# Altium project PA_stage_Thesis.PrjPcb
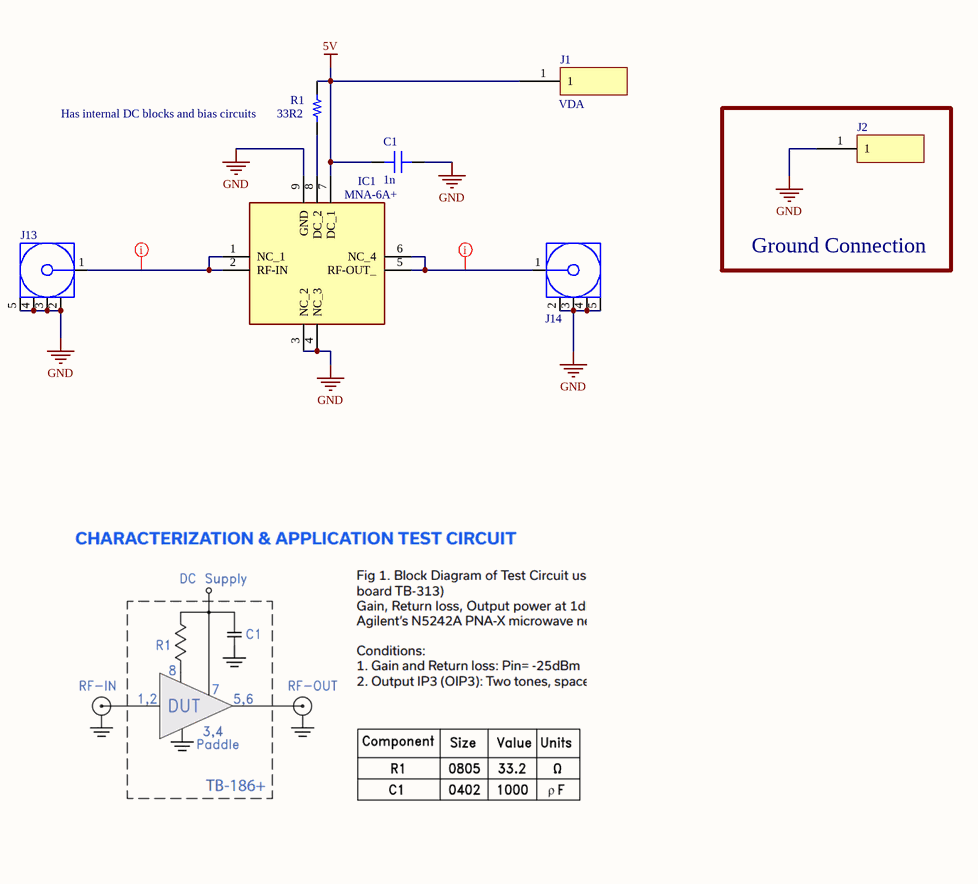
[diagram p0: MNA6A.SchDoc]
4 sheets, 98 parts. Net scope: global (net labels, ports and power ports of the same name join across sheets).
Board file: PCB1.PcbDoc
Sheets:
  MNA6A.SchDoc
  QPA9120.SchDoc
  TQP9111_Sparam_opt.SchDoc
  TQP9111_Devboard_opt.SchDoc

## Sheet MNA6A.SchDoc
size A4; SheetNumber: 1; SheetTotal: 4

### Parts
C1  1n  [CAP 0603_1608 RF]
IC1  MNA-6A+  [MNA6A]
J1  Nail_Head  [Nail_Head]  (value not drawn)
J2  Nail_Head  [Nail_Head]  (value not drawn)
J13  60312202114513  [60312202114513]  (value not drawn)
J14  60312202114513  [60312202114513]  (value not drawn)
R1  33R2  [RES 0805_2012]

### Blocks framed on the sheet
Ground Connection: J2

### Nets
5V: C1.1 IC1.7(DC_1) J1.1 R1.2
GND: C1.2 IC1.3(NC_2) IC1.4(NC_3) IC1.9(GND) J2.1 J13.2(GND) J13.3(GND) J13.4(GND) J13.5(GND) J14.2(GND) J14.3(GND) J14.4(GND) J14.5(GND)
NetIC1_1: IC1.1(NC_1) IC1.2(RF-IN) J13.1(Signal)
NetIC1_5: IC1.5(RF-OUT_) IC1.6(NC_4) J14.1(Signal)
NetIC1_8: IC1.8(DC_2) R1.1

### Layout directives
net class CPWG: NetIC1_1, NetIC1_5

### Notes on the sheet
- (near R1) Has internal DC blocks and bias circuits
- (near J1) VDA

### Library data of the parts
C1 = UMK107SD102JA-T: CAP CER 1000PF 50V 0603; manufacturer: Taiyo Yuden; Tolerance: ±5%; Part Number: UMK107SD102JA-T; Applications: RF, Microwave, High Frequency; Capacitance: 1000pF; componentlink1description: Datasheet; componentlink1url: http://www.yuden.co.jp/productdata/catalog/mlcc07_e.pdf; componentlink2description: DigiKey Link; componentlink2url: http://digikey.com/product-detail/en/taiyo-yuden/UMK107SD102JA-T/587-1069-1-ND/930846; Device Package: 0603 (1608 Metric); Features: Low Distortion; lastupdated: 02/09/2020 01:17:16; Lifecycle Status: Active; Minimum Order: 1; Mounting Type: Surface Mount, MLCC; Operating Temperature: -55°C ~ 125°C; Package / Case: 0603 (1608 Metric); packaging: TapeAndReel; partid: 885; Part Status: Active; price: 0.07; series: CFCAP™; Size / Dimension: 0.063" L x 0.031" W (1.60mm x 0.80mm); Supplier 1: DigiKey; Supplier Part Number 1: 587-1069-1-ND; Thickness (Max): 0.035" (0.90mm); value: 1000pF; Voltage - Rated: 50V
IC1 = MNA-6A+: Integrated Circuit; Manufacturer_Name: Mini-Circuits; Height: 0.9916mm; Manufacturer_Part_Number: MNA-6A+; Mouser Part Number: 139-MNA-6A; Mouser Price/Stock: https://www.mouser.co.uk/ProductDetail/Mini-Circuits/MNA-6A%2b?qs=xZ%2FP%252Ba9zWqa51VJkRRE67Q%3D%3D; Supplier 1: Digi-Key; Supplier Part Number 1: 3157-MNA-6A+CT-ND
J1 J2 = Nail_Head: 1460-2-00-80-00-00-03-0 Mill-Max; Supplier 1: Farnell; Supplier Part Number 1: 3889056
J13 J14 = 60312202114513: WR-SMA Connector, PCB End Launch Jack, 6.35SQ Flange Flat Tab 1.6mm, DC~18GHz, 50Ohm; Manufacturer: Wurth Elektronik; Center Contact Diameter: 0.51 WIDE x 0.25 THK; Connector Type: SMA; Interface Type: MIL-STD-348; Manufacturer Part Number: 60312202114513; Category: Coaxial Connectors; Match Code: WR-SMA; ComponentLink1Description: Website Link; ComponentLink1URL: https://www.we-online.com/redexpert/article/60312202114513?ad; ComponentLink2Description: Datasheet Link; ComponentLink2URL: https://www.we-online.com/redexpert/spec/60312202114513?ad; Mount: End Launch; Operating Temperature Max: 165°C; Operating Temperature Min: -65°C; Packaging: Tray; Frequency Range: DC~18GHz; Gender: Jack; Impedance: 50Ohm; Orientation: Straight
R1 = RCS080533R2FKEA: RES SMD 33.2 OHM 1% 1/2W 0805; Manufacturer: Vishay Dale; Power (Watts): 0.5W, 1/2W; Resistance: 33.2 Ohms; Temperature Coefficient: ±100ppm/°C; Part Number: RCS080533R2FKEA; Value: 33R2; ComponentLink1Description: Datasheet; ComponentLink1URL: http://www.vishay.com/docs/20065/rcse3.pdf; ComponentLink2Description: DigiKey Link; ComponentLink2URL: https://www.digikey.com/en/products/detail/vishay-dale/RCS080533R2FKEA/5866976; Composition: Thick Film; Device Package: 0805 (2012 Metric); Features: Automotive AEC-Q200, Pulse Withstanding; Height - Seated (Max): 0.020" (0.50mm); LastUpdated: 21/05/2023 19:41:30; Lifecycle Status: Active; Minimum Order: 1; Number of Terminations: 2; Operating Temperature: -55°C ~ 155°C; Package / Case: 0805 (2012 Metric); Packaging: TapeAndReel; PartId: 34966; Part Status: Active; Price: 0.02; Ratings: AEC-Q200; Series: RCS e3; Size / Dimension: 0.079" L x 0.049" W (2.00mm x 1.25mm); Supplier 1: DigiKey; Supplier Part Number 1: 541-2830-1-ND; Supplier Device Package: 0805; Tolerance: ±1%

## Sheet QPA9120.SchDoc
size A4; SheetNumber: 2; SheetTotal: 4
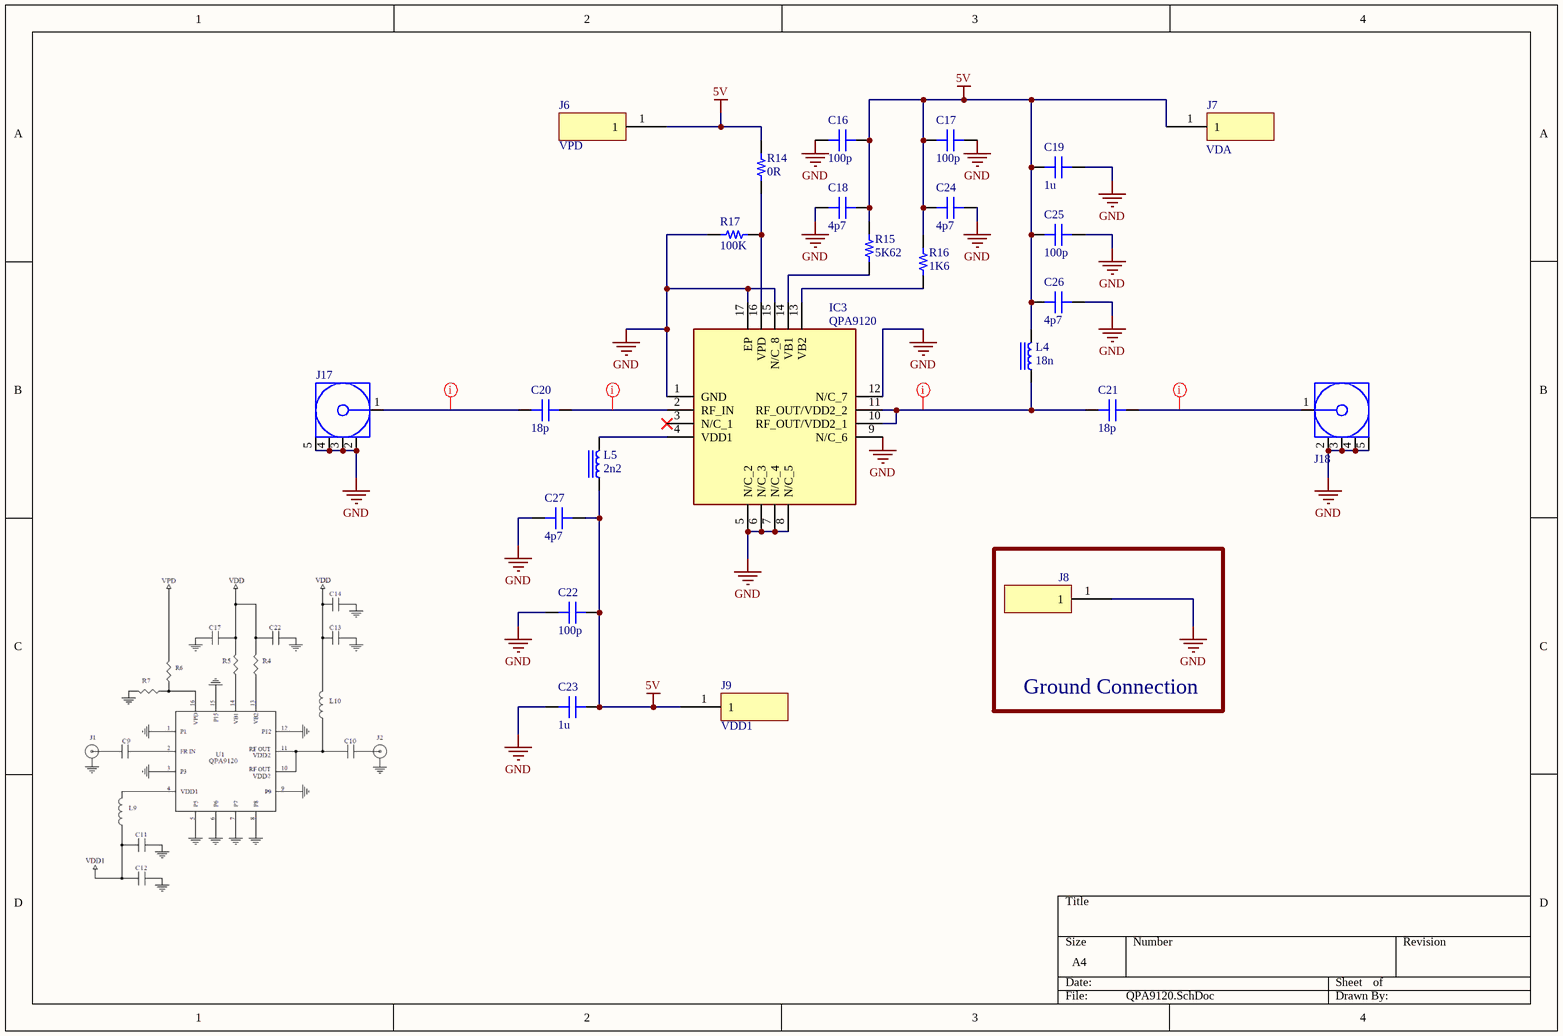
[diagram p1: QPA9120.SchDoc]

### Parts
C16  100p  [CAP 0603_1608 RF]
C17  100p  [CAP 0603_1608 RF]
C18  4p7  [CAP 0402_1005 RF]
C19  1u  [CAP 0603_1608]
C20  18p  [CAP 0402_1005 RF]
C21  18p  [CAP 0402_1005 RF]
C22  100p  [CAP 0603_1608 RF]
C23  1u  [CAP 0603_1608]
C24  4p7  [CAP 0402_1005 RF]
C25  100p  [CAP 0603_1608 RF]
C26  4p7  [CAP 0402_1005 RF]
C27  4p7  [CAP 0402_1005 RF]
IC3  QPA9120  [QFN50P300X300X86-17N-D]
J6  Nail_Head  [Nail_Head]  (value not drawn)
J7  Nail_Head  [Nail_Head]  (value not drawn)
J8  Nail_Head  [Nail_Head]  (value not drawn)
J9  Nail_Head  [Nail_Head]  (value not drawn)
J17  60312202114513  [60312202114513]  (value not drawn)
J18  60312202114513  [60312202114513]  (value not drawn)
L4  18n  [IND 0402_1005 RF WW]
L5  2n2  [IND 0402_1005 RF WW]
R14  0R  [RES 0603_1608]
R15  5K62  [RES 0402_1005]
R16  1K6  [RES 0402_1005]
R17  100K  [RES 0402_1005]

### Blocks framed on the sheet
Ground Connection: J8

### Nets
5V: C16.2 C17.1 C18.2 C19.1 C22.2 C23.2 C24.1 C25.1 C26.1 C27.2 J6.1 J7.1 J9.1 L4.2 L5.1 R14.2 R15.2 R16.2
GND: C16.1 C17.2 C18.1 C19.2 C22.1 C23.1 C24.2 C25.2 C26.2 C27.1 IC3.1(GND) IC3.5(N/C_2) IC3.6(N/C_3) IC3.7(N/C_4) IC3.8(N/C_5) IC3.9(N/C_6) IC3.12(N/C_7) IC3.15(N/C_8) IC3.17(EP) J8.1 J17.2(GND) J17.3(GND) J17.4(GND) J17.5(GND) J18.2(GND) J18.3(GND) J18.4(GND) J18.5(GND) R17.1
NetC20_1: C20.1 J17.1(Signal)
NetC20_2: C20.2 IC3.2(RF_IN)
NetC21_1: C21.1 IC3.10(RF_OUT/VDD2_1) IC3.11(RF_OUT/VDD2_2) L4.1
NetC21_2: C21.2 J18.1(Signal)
NetIC3_4: IC3.4(VDD1) L5.2
NetIC3_13: IC3.13(VB2) R16.1
NetIC3_14: IC3.14(VB1) R15.1
NetIC3_16: IC3.16(VPD) R14.1 R17.2

Not connected (* = marked no-connect by the designer): IC3 3(N/C_1)*

### Layout directives
net class CPWG: NetC20_1, NetC20_2, NetC21_1, NetC21_2

### Notes on the sheet
- (near J6) VPD
- (near J7) VDA
- (near J9) VDD1

### Library data of the parts
C16 C17 C22 C25 = 600S101GW250XT: CAP CER 100PF 250V NP0 0603; manufacturer: American Technical Ceramics; Temperature Coefficient: C0G, NP0; Tolerance: ±2%; Part Number: 600S101GW250XT; Applications: RF, Microwave, High Frequency, Bypass, Decoupling; Capacitance: 100 pF; componentlink1description: Datasheet; componentlink1url: http://www.atceramics.com/UserFiles/600s.pdf; componentlink2description: DigiKey Link; componentlink2url: https://www.digikey.com/en/products/detail/american-technical-ceramics/600S101GW250XT/3908987; Device Package: 0603 (1608 Metric); Features: High Q, Low Loss, Ultra Low ESR; lastupdated: 08/02/2024 21:16:59; Lifecycle Status: Active; Minimum Order: 1; Mounting Type: Surface Mount, MLCC; Operating Temperature: -55°C ~ 125°C; Package / Case: 0603 (1608 Metric); packaging: TapeAndReel; partid: 2165; Part Status: Active; price: 0.66; series: ATC 600S; Size / Dimension: 0.063" L x 0.032" W (1.60mm x 0.81mm); Supplier 1: DigiKey; Supplier Part Number 1: 1284-1931-1-ND; Thickness (Max): 0.035" (0.89mm); value: 100 pF; Voltage - Rated: 250V
C18 C24 C26 C27 = 600L4R7BT200T: CAP CER 4.7PF 200V C0G/NP0 0402; manufacturer: American Technical Ceramics; Temperature Coefficient: C0G, NP0; Tolerance: ±0.1pF; Part Number: 600L4R7BT200T; Applications: RF, Microwave, High Frequency, Bypass, Decoupling; Capacitance: 4.7 pF; componentlink1description: Datasheet; componentlink1url: http://www.atceramics.com/UserFiles/600l.pdf; componentlink2description: DigiKey Link; componentlink2url: https://www.digikey.com/en/products/detail/american-technical-ceramics/600L4R7BT200T/3905170; Device Package: 0402 (1005 Metric); Features: High Q, Low Loss, Ultra Low ESR; lastupdated: 08/02/2024 21:11:52; Lifecycle Status: Active; Minimum Order: 1; Mounting Type: Surface Mount, MLCC; Operating Temperature: -55°C ~ 125°C; Package / Case: 0402 (1005 Metric); packaging: TapeAndReel; partid: 546; Part Status: Active; price: 0.28; series: ATC 600L; Size / Dimension: 0.040" L x 0.020" W (1.02mm x 0.51mm); Supplier 1: DigiKey; Supplier Part Number 1: 1284-1129-1-ND; Thickness (Max): 0.024" (0.60mm); value: 4.7 pF; Voltage - Rated: 200V
C19 C23 = GCM188R71E105KA64J: CAP CER 1UF 25V X7R 0603; manufacturer: Murata Electronics; Capacitance: 1 µF; Tolerance: ±10%; Part Number: GCM188R71E105KA64J; Value: 1u; Applications: Automotive; componentlink1description: Datasheet; componentlink1url: https://www.murata.com/-/media/webrenewal/support/library/catalog/products/capacitor/ceramiccapacitor/c03e.ashx?la=en-us&cvid=20200707014404000000; componentlink2description: DigiKey Link; componentlink2url: https://www.digikey.com/en/products/detail/murata-electronics/GCM188R71E105KA64J/4903957; Device Package: 0603 (1608 Metric); lastupdated: 09/02/2024 20:09:55; Lifecycle Status: Active; Minimum Order: 1; Mounting Type: Surface Mount, MLCC; Operating Temperature: -55°C ~ 125°C; Package / Case: 0603 (1608 Metric); packaging: TapeAndReel; partid: 34745; Part Status: Active; price: 0.02; Ratings: AEC-Q200; series: GCM; Size / Dimension: 0.063" L x 0.031" W (1.60mm x 0.80mm); Supplier 1: DigiKey; Supplier Part Number 1: 490-GCM188R71E105KA64JCT-ND; Temperature Coefficient: X7R; Thickness (Max): 0.035" (0.90mm); Voltage - Rated: 25V
C20 C21 = 600L180GT200T: CAP CER 18PF 200V NP0 0402; manufacturer: American Technical Ceramics; Temperature Coefficient: C0G, NP0; Tolerance: ±2%; Part Number: 600L180GT200T; Applications: RF, Microwave, High Frequency, Bypass, Decoupling; Capacitance: 18 pF; componentlink1description: Datasheet; componentlink1url: http://www.atceramics.com/UserFiles/600l.pdf; componentlink2description: DigiKey Link; componentlink2url: https://www.digikey.com/en/products/detail/american-technical-ceramics/600L180GT200T/3908919; Device Package: 0402 (1005 Metric); Features: High Q, Low Loss, Ultra Low ESR; lastupdated: 08/02/2024 21:11:47; Lifecycle Status: Active; Minimum Order: 1; Mounting Type: Surface Mount, MLCC; Operating Temperature: -55°C ~ 125°C; Package / Case: 0402 (1005 Metric); packaging: TapeAndReel; partid: 2016; Part Status: Active; price: 0.49; series: ATC 600L; Size / Dimension: 0.040" L x 0.020" W (1.02mm x 0.51mm); Supplier 1: DigiKey; Supplier Part Number 1: 1284-1910-1-ND; Thickness (Max): 0.024" (0.60mm); value: 18 pF; Voltage - Rated: 200V
IC3 = QPA9120: Integrated Circuit; Manufacturer_Name: Qorvo; Datasheet Link: https://www.qorvo.com/products/d/da006507; Height: 0.855mm; Manufacturer_Part_Number: QPA9120; Mouser Part Number: N/A; Mouser Price/Stock: https://www.mouser.com/Search/Refine.aspx?Keyword=N%2FA
J6-J9 = Nail_Head: 1460-2-00-80-00-00-03-0 Mill-Max; Supplier 1: Farnell; Supplier Part Number 1: 3889056
J17 J18 = 60312202114513: as J13 on sheet MNA6A; Manufacturer Part Number: 60312202114513; Category: Coaxial Connectors; Match Code: WR-SMA; ComponentLink1Description: Website Link; ComponentLink1URL: https://www.we-online.com/redexpert/article/60312202114513?ad; ComponentLink2Description: Datasheet Link; ComponentLink2URL: https://www.we-online.com/redexpert/spec/60312202114513?ad; Mount: End Launch; Operating Temperature Max: 165°C; Operating Temperature Min: -65°C; Packaging: Tray; Frequency Range: DC~18GHz; Gender: Jack; Impedance: 50Ohm; Orientation: Straight
L4 = LQW15AN18NG8ZD: FIXED IND 18NH 1.05A 0.13OHM SMD; Manufacturer: Murata Electronics; DC Resistance (DCR): 130mOhm Max; Frequency - Self Resonant: 5.2GHz; Inductance Frequency - Test: 100 MHz; Material - Core: Non-Magnetic; Q @ Freq: 30 @ 250MHz; Shielding: Unshielded; Tolerance: ±2%; Type: Drum Core, Wirewound; Part Number: LQW15AN18NG8ZD; ComponentLink1Description: Datasheet; ComponentLink1URL: https://search.murata.co.jp/Ceramy/image/img/P02/JELF243A-9138.pdf; ComponentLink2Description: DigiKey Link; ComponentLink2URL: https://www.digikey.com/en/products/detail/murata-electronics/LQW15AN18NG8ZD/6798772; Current Rating (Amps): 1.05 A; Device Package: 0402 (1005 Metric); Height - Seated (Max): 0.024" (0.60mm); Inductance: 18 nH; LastUpdated: 11/03/2024 07:55:40; Lifecycle Status: Active; Minimum Order: 1; Mounting Type: Surface Mount; Operating Temperature: -55°C ~ 125°C; Package / Case: 0402 (1005 Metric); Packaging: TapeAndReel; PartId: 193; Part Status: Active; Price: 0.07; Ratings: AEC-Q200; Series: LQW15; Size / Dimension: 0.039" L x 0.024" W (1.00mm x 0.60mm); Supplier 1: DigiKey; Supplier Part Number 1: 490-15347-1-ND; Supplier Device Package: 0402 (1005 Metric); Value: 18 nH
L5 = LQW15AN2N2D8ZD: FIXED IND 2.2NH 2.53A 0.022OHM; Manufacturer: Murata Electronics; DC Resistance (DCR): 22mOhm Max; Frequency - Self Resonant: 15.5GHz; Inductance Frequency - Test: 100 MHz; Material - Core: Non-Magnetic; Q @ Freq: 30 @ 250MHz; Shielding: Unshielded; Tolerance: ±0.5nH; Type: Drum Core, Wirewound; Part Number: LQW15AN2N2D8ZD; ComponentLink1Description: Datasheet; ComponentLink1URL: https://search.murata.co.jp/Ceramy/image/img/P02/JELF243A-9138.pdf; ComponentLink2Description: DigiKey Link; ComponentLink2URL: https://www.digikey.com/en/products/detail/murata-electronics/LQW15AN2N2D8ZD/6798802; Current Rating (Amps): 2.53 A; Device Package: 0402 (1005 Metric); Height - Seated (Max): 0.024" (0.60mm); Inductance: 2.2 nH; LastUpdated: 11/03/2024 07:55:41; Lifecycle Status: Active; Minimum Order: 1; Mounting Type: Surface Mount; Operating Temperature: -55°C ~ 125°C; Package / Case: 0402 (1005 Metric); Packaging: TapeAndReel; PartId: 45; Part Status: Active; Price: 0.06; Ratings: AEC-Q200; Series: LQW15; Size / Dimension: 0.039" L x 0.024" W (1.00mm x 0.60mm); Supplier 1: DigiKey; Supplier Part Number 1: 490-15377-1-ND; Supplier Device Package: 0402 (1005 Metric); Value: 2.2 nH
R14 = JR0603X26E: 0603 26 AMP JUMPER; Manufacturer: Ohmite; Power (Watts): 0.135W; Resistance: 0 Ohms; Part Number: JR0603X26E; Value: 0R; ComponentLink1Description: Datasheet; ComponentLink1URL: https://www.ohmite.com/assets/docs/res_jr.pdf?r=false; ComponentLink2Description: DigiKey Link; ComponentLink2URL: https://www.digikey.com/en/products/detail/ohmite/JR0603X26E/10233371; Composition: Metal Element; Device Package: 0603 (1608 Metric); Height - Seated (Max): 0.022" (0.55mm); LastUpdated: 12/04/2023 19:32:57; Lifecycle Status: Active; Minimum Order: 1; Number of Terminations: 2; Operating Temperature: -55°C ~ 150°C; Package / Case: 0603 (1608 Metric); Packaging: TapeAndReel; PartId: 6812; Part Status: Active; Price: 0.10; Series: JR; Size / Dimension: 0.063" L x 0.031" W (1.60mm x 0.80mm); Supplier 1: DigiKey; Supplier Part Number 1: JR0603X26ECT-ND; Supplier Device Package: 0603; Tolerance: Jumper
R15 = CRCW04025K62FKED: RES SMD 5.62K OHM 1% 1/16W 0402; Manufacturer: Vishay Dale; Power (Watts): 0.063W, 1/16W; Resistance: 5.62 kOhms; Temperature Coefficient: ±100ppm/°C; Part Number: CRCW04025K62FKED; Value: 5K62; ComponentLink1Description: Datasheet; ComponentLink1URL: http://www.vishay.com/docs/20035/dcrcwe3.pdf; ComponentLink2Description: DigiKey Link; ComponentLink2URL: https://www.digikey.com/en/products/detail/vishay-dale/CRCW04025K62FKED/1178093; Composition: Thick Film; Device Package: 0402 (1005 Metric); Features: Automotive AEC-Q200; Height - Seated (Max): 0.016" (0.40mm); LastUpdated: 09/02/2024 20:29:38; Lifecycle Status: Active; Minimum Order: 1; Number of Terminations: 2; Operating Temperature: -55°C ~ 155°C; Package / Case: 0402 (1005 Metric); Packaging: TapeAndReel; PartId: 16234; Part Status: Active; Price: 0.01; Ratings: AEC-Q200; Series: CRCW; Size / Dimension: 0.039" L x 0.020" W (1.00mm x 0.50mm); Supplier 1: DigiKey; Supplier Part Number 1: 541-5.62KLCT-ND; Supplier Device Package: 0402; Tolerance: ±1%
R16 = CR0402-FX-1601GLF: RES SMD 1.6K OHM 1% 1/16W 0402; Manufacturer: Bourns Inc.; Power (Watts): 0.063W, 1/16W; Resistance: 1.6 kOhms; Temperature Coefficient: ±100ppm/°C; Part Number: CR0402-FX-1601GLF; Value: 1K6; ComponentLink1Description: Datasheet; ComponentLink1URL: https://www.bourns.com/docs/Product-Datasheets/CR0402.pdf; ComponentLink2Description: DigiKey Link; ComponentLink2URL: https://www.digikey.com/en/products/detail/bourns-inc/CR0402-FX-1601GLF/3783173; Composition: Thick Film; Device Package: 0402 (1005 Metric); Height - Seated (Max): 0.016" (0.40mm); LastUpdated: 09/02/2024 20:29:47; Lifecycle Status: Active; Minimum Order: 1; Number of Terminations: 2; Operating Temperature: -55°C ~ 155°C; Package / Case: 0402 (1005 Metric); Packaging: CutTape; PartId: 12857; Part Status: Active; Price: 0.01; Series: CR0402; Size / Dimension: 0.039" L x 0.020" W (1.00mm x 0.50mm); Supplier 1: DigiKey; Supplier Part Number 1: CR0402-FX-1601GLFCT-ND; Supplier Device Package: 0402; Tolerance: ±1%
R17 = CRCW0402100KFKEDHP: RES SMD 100K OHM 1% 1/5W 0402; Manufacturer: Vishay Dale; Power (Watts): 0.2W, 1/5W; Resistance: 100 kOhms; Temperature Coefficient: ±100ppm/°C; Part Number: CRCW0402100KFKEDHP; Value: 100K; ComponentLink1Description: Datasheet; ComponentLink1URL: http://www.vishay.com/docs/20043/crcwhpe3.pdf; ComponentLink2Description: DigiKey Link; ComponentLink2URL: https://www.digikey.com/en/products/detail/vishay-dale/CRCW0402100KFKEDHP/2222540; Composition: Thick Film; Device Package: 0402 (1005 Metric); Features: Automotive AEC-Q200, Pulse Withstanding; Height - Seated (Max): 0.016" (0.40mm); LastUpdated: 09/02/2024 20:29:48; Lifecycle Status: Active; Minimum Order: 1; Number of Terminations: 2; Operating Temperature: -55°C ~ 155°C; Package / Case: 0402 (1005 Metric); Packaging: TapeAndReel; PartId: 12749; Part Status: Active; Price: 0.01; Ratings: AEC-Q200; Series: CRCW-HP; Size / Dimension: 0.039" L x 0.020" W (1.00mm x 0.50mm); Supplier 1: DigiKey; Supplier Part Number 1: 541-100KYCT-ND; Supplier Device Package: 0402; Tolerance: ±1%

## Sheet TQP9111_Sparam_opt.SchDoc
size A4; SheetNumber: 3; SheetTotal: 4
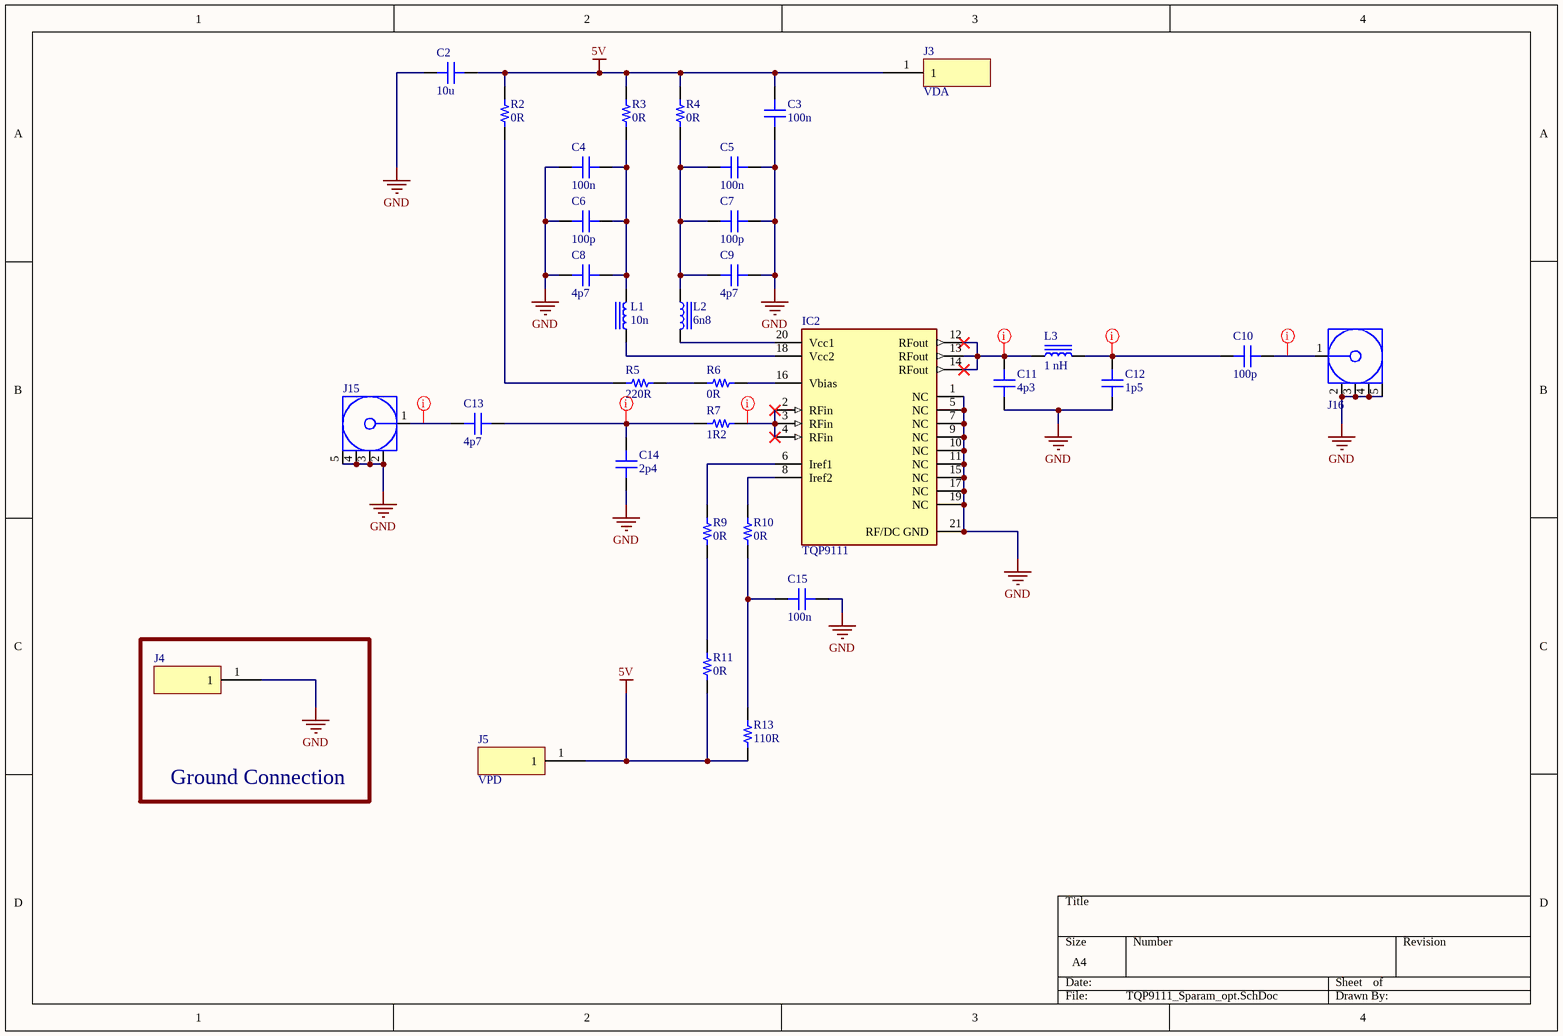
[diagram p2: TQP9111_Sparam_opt.SchDoc]

### Parts
C2  10u  [CAP 0805_2012]
C3  100n  [CAP 0603_1608]
C4  100n  [CAP 0603_1608]
C5  100n  [CAP 0603_1608]
C6  100p  [CAP 0603_1608 RF]
C7  100p  [CAP 0603_1608 RF]
C8  4p7  [CAP 0402_1005 RF]
C9  4p7  [CAP 0402_1005 RF]
C10  100p  [0603_SPECIAL]
C11  4p3  [0402_special]  (mechanical)
C12  1p5  [0402_special]
C13  4p7  [0402_SPECIAL_3]
C14  2p4  [0402_special]
C15  100n  [CAP 0603_1608]
IC2  TQP9111  [FP-TQP9111-MFG]
J3  Nail_Head  [Nail_Head]  (value not drawn)
J4  Nail_Head  [Nail_Head]  (value not drawn)
J5  Nail_Head  [Nail_Head]  (value not drawn)
J15  60312202114513  [60312202114513]  (value not drawn)
J16  60312202114513  [60312202114513]  (value not drawn)
L1  10n  [IND 0603_1608 RF WW]
L2  6n8  [IND 0402_1005 RF WW]
L3  1 nH  [0402]
R2  0R  [RES 0603_1608]
R3  0R  [RES 0603_1608]
R4  0R  [RES 0603_1608]
R5  220R  [RES 0603_1608]
R6  0R  [RES 0603_1608]
R7  1R2  [0402_Special_2]
R9  0R  [RES 0603_1608]
R10  0R  [RES 0603_1608]
R11  0R  [RES 0603_1608]
R13  110R  [RES 0603_1608]

### Blocks framed on the sheet
Ground Connection: J4

### Nets
5V: C2.2 C3.2 J3.1 J5.1 R2.2 R3.2 R4.2 R11.1 R13.1
GND: C2.1 C3.1 C4.1 C5.2 C6.1 C7.2 C8.1 C9.2 C11.1 C12.1 C14.1 C15.2 IC2.1(NC) IC2.5(NC) IC2.7(NC) IC2.9(NC) IC2.10(NC) IC2.11(NC) IC2.15(NC) IC2.17(NC) IC2.19(NC) IC2.21(RF/DC_GND) J4.1 J15.2(GND) J15.3(GND) J15.4(GND) J15.5(GND) J16.2(GND) J16.3(GND) J16.4(GND) J16.5(GND)
NetC4_2: C4.2 C6.2 C8.2 L1.2 R3.1
NetC5_1: C5.1 C7.1 C9.1 L2.2 R4.1
NetC10_1: C10.1 C12.2 L3.2
NetC10_2: C10.2 J16.1(Signal)
NetC11_2: C11.2 IC2.12(RFout) IC2.13(RFout) IC2.14(RFout) L3.1
NetC13_1: C13.1 J15.1(Signal)
NetC13_2: C13.2 C14.2 R7.1
NetC15_1: C15.1 R10.1 R13.2
NetIC2_2: IC2.2(RFin) IC2.3(RFin) IC2.4(RFin) R7.2
NetIC2_6: IC2.6(Iref1) R9.2
NetIC2_8: IC2.8(Iref2) R10.2
NetIC2_16: IC2.16(Vbias) R6.1
NetIC2_18: IC2.18(Vcc2) L1.1
NetIC2_20: IC2.20(Vcc1) L2.1
NetR2_1: R2.1 R5.1
NetR5_2: R5.2 R6.2
NetR9_1: R9.1 R11.2

### Layout directives
net class CPWG_2: NetC10_1, NetC10_2, NetC11_2, NetC13_1, NetC13_2, NetIC2_2

### Notes on the sheet
- (near J3) VDA
- (near J5) VPD

### Library data of the parts
C2 = GRM21BR61H106KE43L: CAP CER 10UF 50V X5R 0805; Value: 10 µF; Part Number: GRM21BR61H106KE43L
C3-C5 C15 = C0603X104K5RAC3316: CAP CER 0603 0.1UF 50V X7R 10%; manufacturer: KEMET; Capacitance: 0.1 µF; Part Number: C0603X104K5RAC3316; Value: 100n; Applications: Automotive, Boardflex Sensitive; componentlink1description: Datasheet; componentlink1url: https://api.kemet.com/component-edge/download/datasheet/C0603X104K5RAC3316.pdf; componentlink2description: DigiKey Link; componentlink2url: https://www.digikey.com/en/products/detail/kemet/C0603X104K5RAC3316/10315788; Device Package: 0603 (1608 Metric); Features: Soft Termination; lastupdated: 26/04/2023 19:06:00; Lifecycle Status: Active; Minimum Order: 1; Mounting Type: Surface Mount, MLCC; Operating Temperature: -55°C ~ 125°C; Package / Case: 0603 (1608 Metric); packaging: TapeAndReel; partid: 11116; Part Status: Active; price: 0.02; Ratings: AEC-Q200; series: SMD Auto X7R VW80808; Size / Dimension: 0.063" L x 0.031" W (1.60mm x 0.80mm); Supplier 1: DigiKey; Supplier Part Number 1: 399-C0603X104K5RAC3316CT-ND; Temperature Coefficient: X7R; Thickness (Max): 0.037" (0.95mm); Tolerance: ±10%; Voltage - Rated: 50V
C6 C7 C10 = 600S101GW250XT: as C16 on sheet QPA9120; Part Number: 600S101GW250XT; Applications: RF, Microwave, High Frequency, Bypass, Decoupling; Capacitance: 100 pF; componentlink1description: Datasheet; componentlink1url: http://www.atceramics.com/UserFiles/600s.pdf; componentlink2description: DigiKey Link; componentlink2url: https://www.digikey.com/en/products/detail/american-technical-ceramics/600S101GW250XT/3908987; Device Package: 0603 (1608 Metric); Features: High Q, Low Loss, Ultra Low ESR; lastupdated: 08/02/2024 21:16:59; Lifecycle Status: Active; Minimum Order: 1; Mounting Type: Surface Mount, MLCC; Operating Temperature: -55°C ~ 125°C; Package / Case: 0603 (1608 Metric); packaging: TapeAndReel; partid: 2165; Part Status: Active; price: 0.66; series: ATC 600S; Size / Dimension: 0.063" L x 0.032" W (1.60mm x 0.81mm); Supplier 1: DigiKey; Supplier Part Number 1: 1284-1931-1-ND; Thickness (Max): 0.035" (0.89mm); value: 100 pF; Voltage - Rated: 250V
C8 C9 C13 = 600L4R7BT200T: as C18 on sheet QPA9120; Part Number: 600L4R7BT200T; Applications: RF, Microwave, High Frequency, Bypass, Decoupling; Capacitance: 4.7 pF; componentlink1description: Datasheet; componentlink1url: http://www.atceramics.com/UserFiles/600l.pdf; componentlink2description: DigiKey Link; componentlink2url: https://www.digikey.com/en/products/detail/american-technical-ceramics/600L4R7BT200T/3905170; Device Package: 0402 (1005 Metric); Features: High Q, Low Loss, Ultra Low ESR; lastupdated: 08/02/2024 21:11:52; Lifecycle Status: Active; Minimum Order: 1; Mounting Type: Surface Mount, MLCC; Operating Temperature: -55°C ~ 125°C; Package / Case: 0402 (1005 Metric); packaging: TapeAndReel; partid: 546; Part Status: Active; price: 0.28; series: ATC 600L; Size / Dimension: 0.040" L x 0.020" W (1.02mm x 0.51mm); Supplier 1: DigiKey; Supplier Part Number 1: 1284-1129-1-ND; Thickness (Max): 0.024" (0.60mm); value: 4.7 pF; Voltage - Rated: 200V
C11 = 600L3R0AW200T: CAP CER 3PF 200V NP0 0402; manufacturer: American Technical Ceramics; Temperature Coefficient: C0G, NP0; Tolerance: ±0.05pF; Part Number: 600L3R0AW200T; Applications: RF, Microwave, High Frequency, Bypass, Decoupling; Capacitance: 3 pF; componentlink1description: Datasheet; componentlink1url: http://www.atceramics.com/UserFiles/600l.pdf; componentlink2description: DigiKey Link; componentlink2url: https://www.digikey.com/en/products/detail/american-technical-ceramics/600L3R0AW200T/3908948; Device Package: 0402 (1005 Metric); Features: High Q, Low Loss, Ultra Low ESR; lastupdated: 08/02/2024 21:11:49; Lifecycle Status: Active; Minimum Order: 1; Mounting Type: Surface Mount, MLCC; Operating Temperature: -55°C ~ 125°C; Package / Case: 0402 (1005 Metric); packaging: TapeAndReel; partid: 1331; Part Status: Active; price: 0.41; series: ATC 600L; Size / Dimension: 0.040" L x 0.020" W (1.02mm x 0.51mm); Supplier 1: DigiKey; Supplier Part Number 1: 478-12303-1-ND; Thickness (Max): 0.024" (0.60mm); value: 3 pF; Voltage - Rated: 200V
C12 = 600L1R5AW200T: CAP CER 1.5PF 200V NP0 0402; manufacturer: American Technical Ceramics; Temperature Coefficient: C0G, NP0; Tolerance: ±0.05pF; Part Number: 600L1R5AW200T; Applications: RF, Microwave, High Frequency, Bypass, Decoupling; Capacitance: 1.5 pF; componentlink1description: Datasheet; componentlink1url: http://www.atceramics.com/UserFiles/600l.pdf; componentlink2description: DigiKey Link; componentlink2url: https://www.digikey.com/en/products/detail/american-technical-ceramics/600L1R5AW200T/3908926; Device Package: 0402 (1005 Metric); Features: High Q, Low Loss, Ultra Low ESR; lastupdated: 08/02/2024 21:11:49; Lifecycle Status: Active; Minimum Order: 1; Mounting Type: Surface Mount, MLCC; Operating Temperature: -55°C ~ 125°C; Package / Case: 0402 (1005 Metric); packaging: TapeAndReel; partid: 1321; Part Status: Active; price: 0.36; series: ATC 600L; Size / Dimension: 0.040" L x 0.020" W (1.02mm x 0.51mm); Supplier 1: DigiKey; Supplier Part Number 1: 478-12301-1-ND; Thickness (Max): 0.024" (0.60mm); value: 1.5 pF; Voltage - Rated: 200V
C14 = 600L2R7AT200T: CAP CER 2.7PF 200V C0G/NP0 0402; Part Number: 600L2R7AT200T
IC2 = CMP-231850-000007-1: Amplifier, Power, 1.8 to 2.7 GHz, 29.8 dB, 32.5 dBm, SMT, 4 x 4 mm; RoHS Compliant: Yes
J3-J5 = Nail_Head: 1460-2-00-80-00-00-03-0 Mill-Max; Supplier 1: Farnell; Supplier Part Number 1: 3889056
J15 J16 = 60312202114513: as J13 on sheet MNA6A; Manufacturer Part Number: 60312202114513; Category: Coaxial Connectors; Match Code: WR-SMA; ComponentLink1Description: Website Link; ComponentLink1URL: https://www.we-online.com/redexpert/article/60312202114513?ad; ComponentLink2Description: Datasheet Link; ComponentLink2URL: https://www.we-online.com/redexpert/spec/60312202114513?ad; Mount: End Launch; Operating Temperature Max: 165°C; Operating Temperature Min: -65°C; Packaging: Tray; Frequency Range: DC~18GHz; Gender: Jack; Impedance: 50Ohm; Orientation: Straight
L1 = LQW18AN10NG8ZD: FIXED IND 10NH 1.6A 52 MOHM; Manufacturer: Murata Electronics; DC Resistance (DCR): 52mOhm Max; Frequency - Self Resonant: 4.75GHz; Inductance Frequency - Test: 100MHz; Material - Core: Non-Magnetic; Q @ Freq: 38 @ 250MHz; Shielding: Unshielded; Tolerance: ±2%; Type: Wirewound; Part Number: LQW18AN10NG8ZD; ComponentLink1Description: Datasheet; ComponentLink1URL: https://search.murata.co.jp/Ceramy/image/img/P02/JELF243A-9133.pdf; ComponentLink2Description: DigiKey Link; ComponentLink2URL: http://digikey.com/product-detail/en/murata-electronics/LQW18AN10NG8ZD/490-15640-1-ND/6800305; Current Rating (Amps): 1.6A; Device Package: 0603 (1608 Metric); Height - Seated (Max): 0.039" (1.00mm); Inductance: 10nH; LastUpdated: 06/09/2020 11:05:21; Lifecycle Status: Active; Minimum Order: 1; Mounting Type: Surface Mount; Operating Temperature: -55°C ~ 125°C; Package / Case: 0603 (1608 Metric); Packaging: TapeAndReel; PartId: 1478; Part Status: Active; Price: 0.10; Ratings: AEC-Q200; Series: LQW18; Size / Dimension: 0.063" L x 0.031" W (1.60mm x 0.80mm); Supplier 1: DigiKey; Supplier Part Number 1: 490-15640-1-ND; Supplier Device Package: 0603 (1608 Metric); Value: 10nH
L2 = AISC-0402HP-6N8J-T: FIXED IND 6.8NH 1.4A 65 MOHM SMD; Manufacturer: Abracon LLC; DC Resistance (DCR): 65mOhm Max; Frequency - Self Resonant: 5.8GHz; Inductance Frequency - Test: 250 MHz; Material - Core: Ceramic; Q @ Freq: 25 @ 250MHz; Shielding: Unshielded; Tolerance: ±5%; Type: Drum Core, Wirewound; Part Number: AISC-0402HP-6N8J-T; ComponentLink1Description: Datasheet; ComponentLink1URL: https://abracon.com/Magnetics/inductors/AISC-0402HP.pdf; ComponentLink2Description: DigiKey Link; ComponentLink2URL: https://www.digikey.com/en/products/detail/abracon-llc/AISC-0402HP-6N8J-T/4215114; Current Rating (Amps): 1.4 A; Device Package: 0402 (1005 Metric); Height - Seated (Max): 0.024" (0.60mm); Inductance: 6.8 nH; LastUpdated: 26/04/2023 20:01:03; Lifecycle Status: Active; Minimum Order: 1; Mounting Type: Surface Mount; Operating Temperature: -40°C ~ 125°C; Package / Case: 0402 (1005 Metric); Packaging: TapeAndReel; PartId: 720; Part Status: Active; Price: 0.10; Series: AISC-0402HP; Size / Dimension: 0.039" L x 0.022" W (1.00mm x 0.55mm); Supplier 1: DigiKey; Supplier Part Number 1: 535-12227-1-ND; Supplier Device Package: 0402 (1005 Metric); Value: 6.8 nH
L3 = 744765010A: FIXED IND 1NH 1.36A 45 MOHM SMD; Manufacturer: Würth Elektronik; DC Resistance (DCR): 45mOhm Max; Frequency - Self Resonant: 6GHz; Inductance Frequency - Test: 250 MHz; Material - Core: Ceramic; Q @ Freq: 13 @ 250MHz; Shielding: Unshielded; Tolerance: ±0.2nH; Type: Drum Core, Wirewound; Part Number: 744765010A; ComponentLink1Description: Datasheet; ComponentLink1URL: https://katalog.we-online.de/pbs/datasheet/744765010A.pdf; ComponentLink2Description: DigiKey Link; ComponentLink2URL: https://www.digikey.com/en/products/detail/würth-elektronik/744765010A/1994068; Current Rating (Amps): 1.36 A; Device Package: 0402 (1005 Metric); Height - Seated (Max): 0.024" (0.60mm); Inductance: 1 nH; LastUpdated: 11/03/2024 07:55:48; Lifecycle Status: Active; Minimum Order: 1; Mounting Type: Surface Mount; Operating Temperature: -40°C ~ 125°C; Package / Case: 0402 (1005 Metric); Packaging: TapeAndReel; PartId: 685; Part Status: Active; Price: 0.27; Ratings: AEC-Q200; Series: WE-KI; Size / Dimension: 0.039" L x 0.022" W (1.00mm x 0.55mm); Supplier 1: DigiKey; Supplier Part Number 1: 732-1703-1-ND; Supplier Device Package: 0402 (1005 Metric); Value: 1 nH
R2-R4 R6 R9-R11 = JR0603X26E: as R14 on sheet QPA9120; Part Number: JR0603X26E; Value: 0R; ComponentLink1Description: Datasheet; ComponentLink1URL: https://www.ohmite.com/assets/docs/res_jr.pdf?r=false; ComponentLink2Description: DigiKey Link; ComponentLink2URL: https://www.digikey.com/en/products/detail/ohmite/JR0603X26E/10233371; Composition: Metal Element; Device Package: 0603 (1608 Metric); Height - Seated (Max): 0.022" (0.55mm); LastUpdated: 12/04/2023 19:32:57; Lifecycle Status: Active; Minimum Order: 1; Number of Terminations: 2; Operating Temperature: -55°C ~ 150°C; Package / Case: 0603 (1608 Metric); Packaging: TapeAndReel; PartId: 6812; Part Status: Active; Price: 0.10; Series: JR; Size / Dimension: 0.063" L x 0.031" W (1.60mm x 0.80mm); Supplier 1: DigiKey; Supplier Part Number 1: JR0603X26ECT-ND; Supplier Device Package: 0603; Tolerance: Jumper
R5 = CPF0603B220RE1: RES SMD 220 OHM 0.1% 1/16W 0603; Manufacturer: TE Connectivity Passive Product; Power (Watts): 0.063W, 1/16W; Resistance: 220 Ohms; Temperature Coefficient: ±25ppm/°C; Part Number: CPF0603B220RE1; Value: 220R; ComponentLink1Description: Datasheet; ComponentLink1URL: https://www.te.com/commerce/DocumentDelivery/DDEController?Action=srchrtrv&DocNm=1773200&DocType=DS&DocLang=English; ComponentLink2Description: DigiKey Link; ComponentLink2URL: https://www.digikey.com/en/products/detail/te-connectivity-passive-product/CPF0603B220RE1/2381904; Composition: Thin Film; Device Package: 0603 (1608 Metric); Height - Seated (Max): 0.022" (0.55mm); LastUpdated: 26/04/2023 19:28:28; Lifecycle Status: Active; Minimum Order: 1; Number of Terminations: 2; Operating Temperature: -55°C ~ 155°C; Package / Case: 0603 (1608 Metric); Packaging: TapeAndReel; PartId: 5753; Part Status: Active; Price: 0.12; Series: CPF, Neohm; Size / Dimension: 0.061" L x 0.031" W (1.55mm x 0.80mm); Supplier 1: DigiKey; Supplier Part Number 1: A103065CT-ND; Supplier Device Package: 0603; Tolerance: ±0.1%
R7 = JR0402X20E: 0402 20 AMP JUMPER; Value: 0 Ohms; Part Number: JR0402X20E
R13 = RN73H1JTTD1100B25: RES 110 OHM 0.1% 1/10W 0603; Manufacturer: KOA Speer Electronics, Inc.; Power (Watts): 0.1W, 1/10W; Resistance: 110 Ohms; Temperature Coefficient: ±25ppm/°C; Part Number: RN73H1JTTD1100B25; Value: 110R; ComponentLink2Description: DigiKey Link; ComponentLink2URL: https://www.digikey.com/en/products/detail/koa-speer-electronics-inc/RN73H1JTTD1100B25/10685623; Composition: Metal Film; Device Package: 0603 (1608 Metric); Features: Automotive AEC-Q200, Moisture Resistant; Height - Seated (Max): 0.022" (0.55mm); LastUpdated: 26/04/2023 19:26:31; Lifecycle Status: Active; Minimum Order: 1; Number of Terminations: 2; Operating Temperature: -55°C ~ 155°C; Package / Case: 0603 (1608 Metric); Packaging: TapeAndReel; PartId: 71509; Part Status: Active; Price: 0.09; Ratings: AEC-Q200; Series: RN73H; Size / Dimension: 0.063" L x 0.031" W (1.60mm x 0.80mm); Supplier 1: DigiKey; Supplier Part Number 1: 2019-RN73H1JTTD1100B25CT-ND; Supplier Device Package: 0603; Tolerance: ±0.1%

## Sheet TQP9111_Devboard_opt.SchDoc
size A4; SheetNumber: 4; SheetTotal: 4
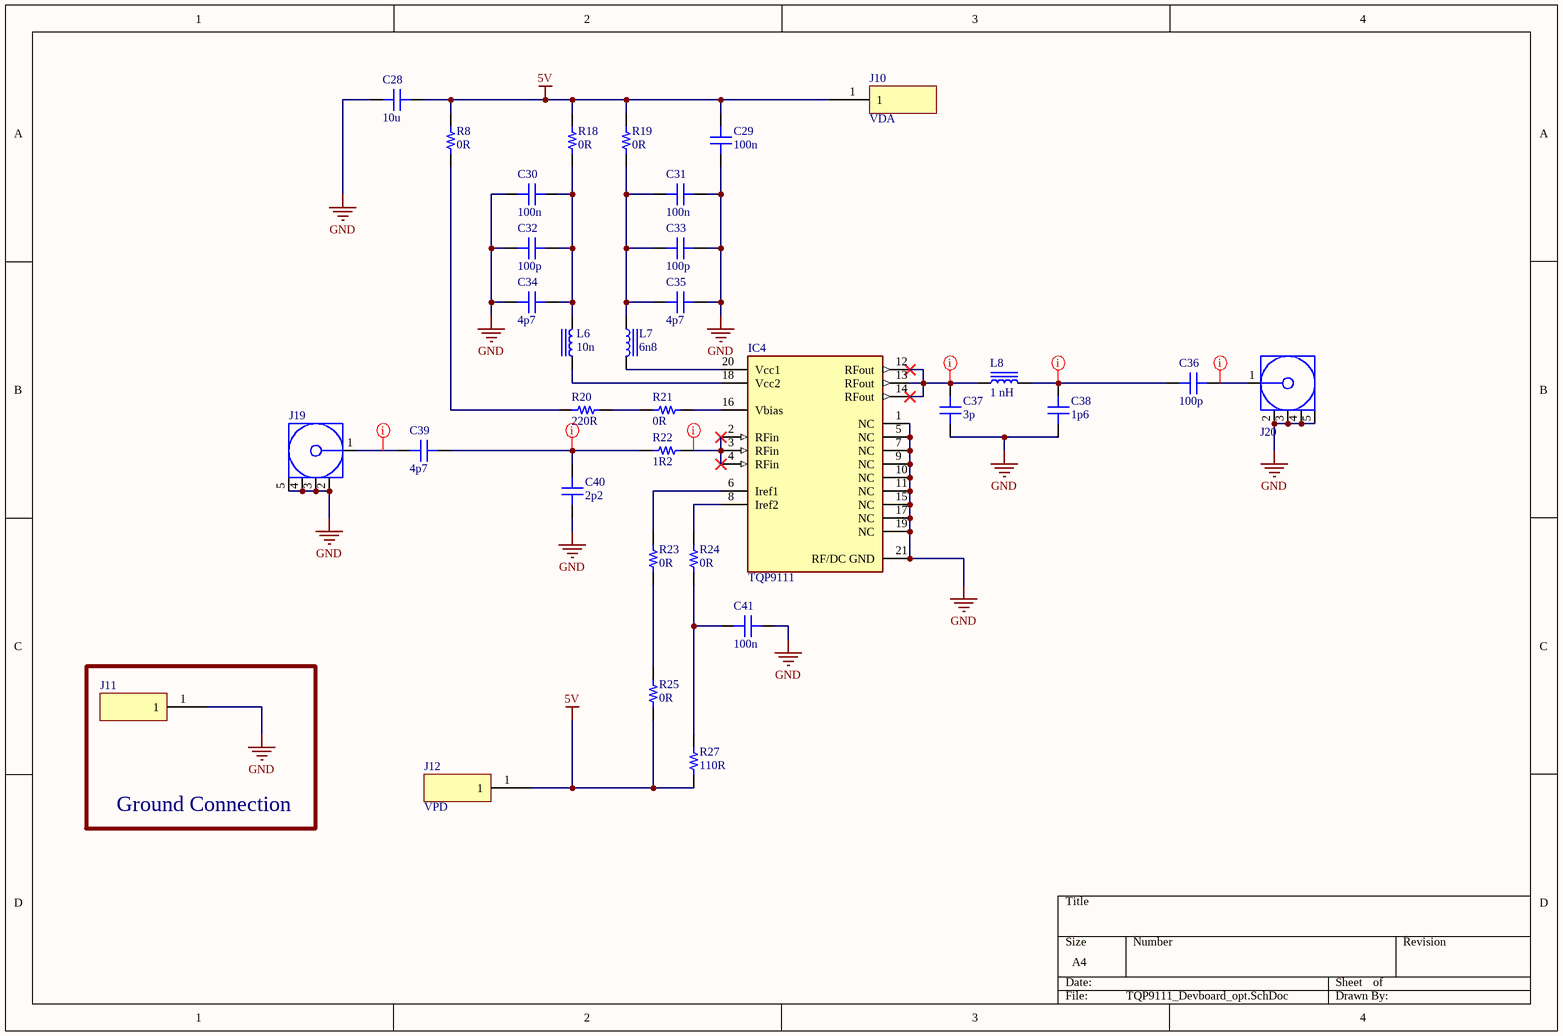
[diagram p3: TQP9111_Devboard_opt.SchDoc]

### Parts
C28  10u  [CAP 0805_2012]
C29  100n  [CAP 0603_1608]
C30  100n  [CAP 0603_1608]
C31  100n  [CAP 0603_1608]
C32  100p  [CAP 0603_1608 RF]
C33  100p  [CAP 0603_1608 RF]
C34  4p7  [CAP 0402_1005 RF]
C35  4p7  [CAP 0402_1005 RF]
C36  100p  [0603_SPECIAL]
C37  3p  [0402_special]  (mechanical)
C38  1p6  [0402_special]
C39  4p7  [0402_SPECIAL_3]
C40  2p2  [0402_special]
C41  100n  [CAP 0603_1608]
IC4  TQP9111  [FP-TQP9111-MFG]
J10  Nail_Head  [Nail_Head]  (value not drawn)
J11  Nail_Head  [Nail_Head]  (value not drawn)
J12  Nail_Head  [Nail_Head]  (value not drawn)
J19  60312202114513  [60312202114513]  (value not drawn)
J20  60312202114513  [60312202114513]  (value not drawn)
L6  10n  [IND 0603_1608 RF WW]
L7  6n8  [IND 0402_1005 RF WW]
L8  1 nH  [0402]
R8  0R  [RES 0603_1608]
R18  0R  [RES 0603_1608]
R19  0R  [RES 0603_1608]
R20  220R  [RES 0603_1608]
R21  0R  [RES 0603_1608]
R22  1R2  [0402_Special_2]
R23  0R  [RES 0603_1608]
R24  0R  [RES 0603_1608]
R25  0R  [RES 0603_1608]
R27  110R  [RES 0603_1608]

### Blocks framed on the sheet
Ground Connection: J11

### Nets
5V: C28.2 C29.2 J10.1 J12.1 R8.2 R18.2 R19.2 R25.1 R27.1
GND: C28.1 C29.1 C30.1 C31.2 C32.1 C33.2 C34.1 C35.2 C37.1 C38.1 C40.1 C41.2 IC4.1(NC) IC4.5(NC) IC4.7(NC) IC4.9(NC) IC4.10(NC) IC4.11(NC) IC4.15(NC) IC4.17(NC) IC4.19(NC) IC4.21(RF/DC_GND) J11.1 J19.2(GND) J19.3(GND) J19.4(GND) J19.5(GND) J20.2(GND) J20.3(GND) J20.4(GND) J20.5(GND)
NetC30_2: C30.2 C32.2 C34.2 L6.2 R18.1
NetC31_1: C31.1 C33.1 C35.1 L7.2 R19.1
NetC36_1: C36.1 C38.2 L8.2
NetC36_2: C36.2 J20.1(Signal)
NetC37_2: C37.2 IC4.12(RFout) IC4.13(RFout) IC4.14(RFout) L8.1
NetC39_1: C39.1 J19.1(Signal)
NetC39_2: C39.2 C40.2 R22.1
NetC41_1: C41.1 R24.1 R27.2
NetIC4_2: IC4.2(RFin) IC4.3(RFin) IC4.4(RFin) R22.2
NetIC4_6: IC4.6(Iref1) R23.2
NetIC4_8: IC4.8(Iref2) R24.2
NetIC4_16: IC4.16(Vbias) R21.1
NetIC4_18: IC4.18(Vcc2) L6.1
NetIC4_20: IC4.20(Vcc1) L7.1
NetR8_1: R8.1 R20.1
NetR20_2: R20.2 R21.2
NetR23_1: R23.1 R25.2

### Layout directives
net class CPWG_2: NetC36_1, NetC36_2, NetC37_2, NetC39_1, NetC39_2, NetIC4_2

### Notes on the sheet
- (near J10) VDA
- (near J12) VPD

### Library data of the parts
C28 = GRM21BR61H106KE43L: CAP CER 10UF 50V X5R 0805; Value: 10 µF; Part Number: GRM21BR61H106KE43L
C29-C31 C41 = C0603X104K5RAC3316: as C3 on sheet TQP9111_Sparam_opt; Part Number: C0603X104K5RAC3316; Value: 100n; Applications: Automotive, Boardflex Sensitive; componentlink1description: Datasheet; componentlink1url: https://api.kemet.com/component-edge/download/datasheet/C0603X104K5RAC3316.pdf; componentlink2description: DigiKey Link; componentlink2url: https://www.digikey.com/en/products/detail/kemet/C0603X104K5RAC3316/10315788; Device Package: 0603 (1608 Metric); Features: Soft Termination; lastupdated: 26/04/2023 19:06:00; Lifecycle Status: Active; Minimum Order: 1; Mounting Type: Surface Mount, MLCC; Operating Temperature: -55°C ~ 125°C; Package / Case: 0603 (1608 Metric); packaging: TapeAndReel; partid: 11116; Part Status: Active; price: 0.02; Ratings: AEC-Q200; series: SMD Auto X7R VW80808; Size / Dimension: 0.063" L x 0.031" W (1.60mm x 0.80mm); Supplier 1: DigiKey; Supplier Part Number 1: 399-C0603X104K5RAC3316CT-ND; Temperature Coefficient: X7R; Thickness (Max): 0.037" (0.95mm); Tolerance: ±10%; Voltage - Rated: 50V
C32 C33 C36 = 600S101GW250XT: as C16 on sheet QPA9120; Part Number: 600S101GW250XT; Applications: RF, Microwave, High Frequency, Bypass, Decoupling; Capacitance: 100 pF; componentlink1description: Datasheet; componentlink1url: http://www.atceramics.com/UserFiles/600s.pdf; componentlink2description: DigiKey Link; componentlink2url: https://www.digikey.com/en/products/detail/american-technical-ceramics/600S101GW250XT/3908987; Device Package: 0603 (1608 Metric); Features: High Q, Low Loss, Ultra Low ESR; lastupdated: 08/02/2024 21:16:59; Lifecycle Status: Active; Minimum Order: 1; Mounting Type: Surface Mount, MLCC; Operating Temperature: -55°C ~ 125°C; Package / Case: 0603 (1608 Metric); packaging: TapeAndReel; partid: 2165; Part Status: Active; price: 0.66; series: ATC 600S; Size / Dimension: 0.063" L x 0.032" W (1.60mm x 0.81mm); Supplier 1: DigiKey; Supplier Part Number 1: 1284-1931-1-ND; Thickness (Max): 0.035" (0.89mm); value: 100 pF; Voltage - Rated: 250V
C34 C35 C39 = 600L4R7BT200T: as C18 on sheet QPA9120; Part Number: 600L4R7BT200T; Applications: RF, Microwave, High Frequency, Bypass, Decoupling; Capacitance: 4.7 pF; componentlink1description: Datasheet; componentlink1url: http://www.atceramics.com/UserFiles/600l.pdf; componentlink2description: DigiKey Link; componentlink2url: https://www.digikey.com/en/products/detail/american-technical-ceramics/600L4R7BT200T/3905170; Device Package: 0402 (1005 Metric); Features: High Q, Low Loss, Ultra Low ESR; lastupdated: 08/02/2024 21:11:52; Lifecycle Status: Active; Minimum Order: 1; Mounting Type: Surface Mount, MLCC; Operating Temperature: -55°C ~ 125°C; Package / Case: 0402 (1005 Metric); packaging: TapeAndReel; partid: 546; Part Status: Active; price: 0.28; series: ATC 600L; Size / Dimension: 0.040" L x 0.020" W (1.02mm x 0.51mm); Supplier 1: DigiKey; Supplier Part Number 1: 1284-1129-1-ND; Thickness (Max): 0.024" (0.60mm); value: 4.7 pF; Voltage - Rated: 200V
C37 = 600L3R0AW200T: as C11 on sheet TQP9111_Sparam_opt; Part Number: 600L3R0AW200T; Applications: RF, Microwave, High Frequency, Bypass, Decoupling; Capacitance: 3 pF; componentlink1description: Datasheet; componentlink1url: http://www.atceramics.com/UserFiles/600l.pdf; componentlink2description: DigiKey Link; componentlink2url: https://www.digikey.com/en/products/detail/american-technical-ceramics/600L3R0AW200T/3908948; Device Package: 0402 (1005 Metric); Features: High Q, Low Loss, Ultra Low ESR; lastupdated: 08/02/2024 21:11:49; Lifecycle Status: Active; Minimum Order: 1; Mounting Type: Surface Mount, MLCC; Operating Temperature: -55°C ~ 125°C; Package / Case: 0402 (1005 Metric); packaging: TapeAndReel; partid: 1331; Part Status: Active; price: 0.41; series: ATC 600L; Size / Dimension: 0.040" L x 0.020" W (1.02mm x 0.51mm); Supplier 1: DigiKey; Supplier Part Number 1: 478-12303-1-ND; Thickness (Max): 0.024" (0.60mm); value: 3 pF; Voltage - Rated: 200V
C38 = 600L1R6BT200T: CAP CER 1.6PF 200V NP0 0402; manufacturer: American Technical Ceramics; Temperature Coefficient: C0G, NP0; Tolerance: ±0.1pF; Part Number: 600L1R6BT200T; Applications: RF, Microwave, High Frequency, Bypass, Decoupling; Capacitance: 1.6 pF; componentlink1description: Datasheet; componentlink1url: http://www.atceramics.com/UserFiles/600l.pdf; componentlink2description: DigiKey Link; componentlink2url: https://www.digikey.com/en/products/detail/american-technical-ceramics/600L1R6BT200T/3908928; Device Package: 0402 (1005 Metric); Features: High Q, Low Loss, Ultra Low ESR; lastupdated: 08/02/2024 21:11:52; Lifecycle Status: Active; Minimum Order: 1; Mounting Type: Surface Mount, MLCC; Operating Temperature: -55°C ~ 125°C; Package / Case: 0402 (1005 Metric); packaging: TapeAndReel; partid: 537; Part Status: Active; price: 0.39; series: ATC 600L; Size / Dimension: 0.040" L x 0.020" W (1.02mm x 0.51mm); Supplier 1: DigiKey; Supplier Part Number 1: 1284-1866-1-ND; Thickness (Max): 0.024" (0.60mm); value: 1.6 pF; Voltage - Rated: 200V
C40 = 600L2R2BT200T: CAP CER 2.2PF 200V C0G/NP0 0402; manufacturer: American Technical Ceramics; Temperature Coefficient: C0G, NP0; Tolerance: ±0.1pF; Part Number: 600L2R2BT200T; Applications: RF, Microwave, High Frequency, Bypass, Decoupling; Capacitance: 2.2 pF; componentlink1description: Datasheet; componentlink1url: http://www.atceramics.com/UserFiles/600l.pdf; componentlink2description: DigiKey Link; componentlink2url: https://www.digikey.com/en/products/detail/american-technical-ceramics/600L2R2BT200T/3905162; Device Package: 0402 (1005 Metric); Features: High Q, Low Loss, Ultra Low ESR; lastupdated: 08/02/2024 21:11:48; Lifecycle Status: Active; Minimum Order: 1; Mounting Type: Surface Mount, MLCC; Operating Temperature: -55°C ~ 125°C; Package / Case: 0402 (1005 Metric); packaging: TapeAndReel; partid: 1591; Part Status: Active; price: 0.39; series: ATC 600L; Size / Dimension: 0.040" L x 0.020" W (1.02mm x 0.51mm); Supplier 1: DigiKey; Supplier Part Number 1: 1284-1120-1-ND; Thickness (Max): 0.024" (0.60mm); value: 2.2 pF; Voltage - Rated: 200V
IC4 = CMP-231850-000007-1: as IC2 on sheet TQP9111_Sparam_opt; RoHS Compliant: Yes
J10-J12 = Nail_Head: 1460-2-00-80-00-00-03-0 Mill-Max; Supplier 1: Farnell; Supplier Part Number 1: 3889056
J19 J20 = 60312202114513: as J13 on sheet MNA6A; Manufacturer Part Number: 60312202114513; Category: Coaxial Connectors; Match Code: WR-SMA; ComponentLink1Description: Website Link; ComponentLink1URL: https://www.we-online.com/redexpert/article/60312202114513?ad; ComponentLink2Description: Datasheet Link; ComponentLink2URL: https://www.we-online.com/redexpert/spec/60312202114513?ad; Mount: End Launch; Operating Temperature Max: 165°C; Operating Temperature Min: -65°C; Packaging: Tray; Frequency Range: DC~18GHz; Gender: Jack; Impedance: 50Ohm; Orientation: Straight
L6 = LQW18AN10NG8ZD: as L1 on sheet TQP9111_Sparam_opt; Part Number: LQW18AN10NG8ZD; ComponentLink1Description: Datasheet; ComponentLink1URL: https://search.murata.co.jp/Ceramy/image/img/P02/JELF243A-9133.pdf; ComponentLink2Description: DigiKey Link; ComponentLink2URL: http://digikey.com/product-detail/en/murata-electronics/LQW18AN10NG8ZD/490-15640-1-ND/6800305; Current Rating (Amps): 1.6A; Device Package: 0603 (1608 Metric); Height - Seated (Max): 0.039" (1.00mm); Inductance: 10nH; LastUpdated: 06/09/2020 11:05:21; Lifecycle Status: Active; Minimum Order: 1; Mounting Type: Surface Mount; Operating Temperature: -55°C ~ 125°C; Package / Case: 0603 (1608 Metric); Packaging: TapeAndReel; PartId: 1478; Part Status: Active; Price: 0.10; Ratings: AEC-Q200; Series: LQW18; Size / Dimension: 0.063" L x 0.031" W (1.60mm x 0.80mm); Supplier 1: DigiKey; Supplier Part Number 1: 490-15640-1-ND; Supplier Device Package: 0603 (1608 Metric); Value: 10nH
L7 = AISC-0402HP-6N8J-T: as L2 on sheet TQP9111_Sparam_opt; Part Number: AISC-0402HP-6N8J-T; ComponentLink1Description: Datasheet; ComponentLink1URL: https://abracon.com/Magnetics/inductors/AISC-0402HP.pdf; ComponentLink2Description: DigiKey Link; ComponentLink2URL: https://www.digikey.com/en/products/detail/abracon-llc/AISC-0402HP-6N8J-T/4215114; Current Rating (Amps): 1.4 A; Device Package: 0402 (1005 Metric); Height - Seated (Max): 0.024" (0.60mm); Inductance: 6.8 nH; LastUpdated: 26/04/2023 20:01:03; Lifecycle Status: Active; Minimum Order: 1; Mounting Type: Surface Mount; Operating Temperature: -40°C ~ 125°C; Package / Case: 0402 (1005 Metric); Packaging: TapeAndReel; PartId: 720; Part Status: Active; Price: 0.10; Series: AISC-0402HP; Size / Dimension: 0.039" L x 0.022" W (1.00mm x 0.55mm); Supplier 1: DigiKey; Supplier Part Number 1: 535-12227-1-ND; Supplier Device Package: 0402 (1005 Metric); Value: 6.8 nH
L8 = 744765010A: as L3 on sheet TQP9111_Sparam_opt; Part Number: 744765010A; ComponentLink1Description: Datasheet; ComponentLink1URL: https://katalog.we-online.de/pbs/datasheet/744765010A.pdf; ComponentLink2Description: DigiKey Link; ComponentLink2URL: https://www.digikey.com/en/products/detail/würth-elektronik/744765010A/1994068; Current Rating (Amps): 1.36 A; Device Package: 0402 (1005 Metric); Height - Seated (Max): 0.024" (0.60mm); Inductance: 1 nH; LastUpdated: 11/03/2024 07:55:48; Lifecycle Status: Active; Minimum Order: 1; Mounting Type: Surface Mount; Operating Temperature: -40°C ~ 125°C; Package / Case: 0402 (1005 Metric); Packaging: TapeAndReel; PartId: 685; Part Status: Active; Price: 0.27; Ratings: AEC-Q200; Series: WE-KI; Size / Dimension: 0.039" L x 0.022" W (1.00mm x 0.55mm); Supplier 1: DigiKey; Supplier Part Number 1: 732-1703-1-ND; Supplier Device Package: 0402 (1005 Metric); Value: 1 nH
R8 R18 R19 R21 R23-R25 = JR0603X26E: as R14 on sheet QPA9120; Part Number: JR0603X26E; Value: 0R; ComponentLink1Description: Datasheet; ComponentLink1URL: https://www.ohmite.com/assets/docs/res_jr.pdf?r=false; ComponentLink2Description: DigiKey Link; ComponentLink2URL: https://www.digikey.com/en/products/detail/ohmite/JR0603X26E/10233371; Composition: Metal Element; Device Package: 0603 (1608 Metric); Height - Seated (Max): 0.022" (0.55mm); LastUpdated: 12/04/2023 19:32:57; Lifecycle Status: Active; Minimum Order: 1; Number of Terminations: 2; Operating Temperature: -55°C ~ 150°C; Package / Case: 0603 (1608 Metric); Packaging: TapeAndReel; PartId: 6812; Part Status: Active; Price: 0.10; Series: JR; Size / Dimension: 0.063" L x 0.031" W (1.60mm x 0.80mm); Supplier 1: DigiKey; Supplier Part Number 1: JR0603X26ECT-ND; Supplier Device Package: 0603; Tolerance: Jumper
R20 = CPF0603B220RE1: as R5 on sheet TQP9111_Sparam_opt; Part Number: CPF0603B220RE1; Value: 220R; ComponentLink1Description: Datasheet; ComponentLink1URL: https://www.te.com/commerce/DocumentDelivery/DDEController?Action=srchrtrv&DocNm=1773200&DocType=DS&DocLang=English; ComponentLink2Description: DigiKey Link; ComponentLink2URL: https://www.digikey.com/en/products/detail/te-connectivity-passive-product/CPF0603B220RE1/2381904; Composition: Thin Film; Device Package: 0603 (1608 Metric); Height - Seated (Max): 0.022" (0.55mm); LastUpdated: 26/04/2023 19:28:28; Lifecycle Status: Active; Minimum Order: 1; Number of Terminations: 2; Operating Temperature: -55°C ~ 155°C; Package / Case: 0603 (1608 Metric); Packaging: TapeAndReel; PartId: 5753; Part Status: Active; Price: 0.12; Series: CPF, Neohm; Size / Dimension: 0.061" L x 0.031" W (1.55mm x 0.80mm); Supplier 1: DigiKey; Supplier Part Number 1: A103065CT-ND; Supplier Device Package: 0603; Tolerance: ±0.1%
R22 = SR731ERTTP1R20F: RES 1.2 OHM 1% 1/6W 0402; Manufacturer: KOA Speer Electronics, Inc.; Power (Watts): 0.167W, 1/6W; Resistance: 1.2 Ohms; Temperature Coefficient: ±200ppm/°C; Part Number: SR731ERTTP1R20F; Value: 1R2; ComponentLink1Description: Datasheet; ComponentLink1URL: http://www.koaspeer.com/catimages/Products/SR73-RT/SR73-RT.pdf; ComponentLink2Description: DigiKey Link; ComponentLink2URL: https://www.digikey.com/en/products/detail/koa-speer-electronics-inc/SR731ERTTP1R20F/9916424; Composition: Thick Film; Device Package: 0402 (1005 Metric); Features: Anti-Sulfur, Automotive AEC-Q200, Current Sense, Moisture Resistant; Height - Seated (Max): 0.016" (0.40mm); LastUpdated: 09/02/2024 20:29:36; Lifecycle Status: Active; Minimum Order: 1; Number of Terminations: 2; Operating Temperature: -55°C ~ 155°C; Package / Case: 0402 (1005 Metric); Packaging: TapeAndReel; PartId: 16999; Part Status: Active; Price: 0.12; Ratings: AEC-Q200; Series: SR73-RT; Size / Dimension: 0.039" L x 0.020" W (1.00mm x 0.50mm); Supplier 1: DigiKey; Supplier Part Number 1: 2019-SR731ERTTP1R20FCT-ND; Supplier Device Package: 0402; Tolerance: ±1%
R27 = RN73H1JTTD1100B25: as R13 on sheet TQP9111_Sparam_opt; Part Number: RN73H1JTTD1100B25; Value: 110R; ComponentLink2Description: DigiKey Link; ComponentLink2URL: https://www.digikey.com/en/products/detail/koa-speer-electronics-inc/RN73H1JTTD1100B25/10685623; Composition: Metal Film; Device Package: 0603 (1608 Metric); Features: Automotive AEC-Q200, Moisture Resistant; Height - Seated (Max): 0.022" (0.55mm); LastUpdated: 26/04/2023 19:26:31; Lifecycle Status: Active; Minimum Order: 1; Number of Terminations: 2; Operating Temperature: -55°C ~ 155°C; Package / Case: 0603 (1608 Metric); Packaging: TapeAndReel; PartId: 71509; Part Status: Active; Price: 0.09; Ratings: AEC-Q200; Series: RN73H; Size / Dimension: 0.063" L x 0.031" W (1.60mm x 0.80mm); Supplier 1: DigiKey; Supplier Part Number 1: 2019-RN73H1JTTD1100B25CT-ND; Supplier Device Package: 0603; Tolerance: ±0.1%

## Nets that join several sheets
5V: MNA6A (C1.1 IC1.7 J1.1 R1.2), QPA9120 (18 pins), TQP9111_Sparam_opt (9 pins), TQP9111_Devboard_opt (9 pins)
GND: MNA6A (13 pins), QPA9120 (29 pins), TQP9111_Sparam_opt (31 pins), TQP9111_Devboard_opt (31 pins)